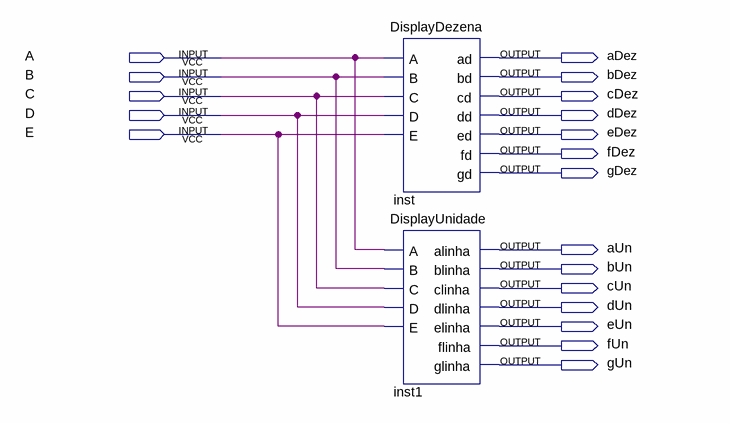
[diagram p0: schematic sheet]
// Quartus schematic Display14.bdf as structural Verilog: 2 symbols, 19 pins
module Display14 (
  input  A,
  input  B,
  input  C,
  input  D,
  input  E,
  output aDez,
  output bDez,
  output cDez,
  output dDez,
  output eDez,
  output fDez,
  output gDez,
  output aUn,
  output bUn,
  output cUn,
  output dUn,
  output eUn,
  output fUn,
  output gUn
);

  DisplayDezena inst (
    .A(A), .B(B), .C(C), .D(D), .E(E), .ad(aDez), .bd(bDez), .cd(cDez), .dd(dDez), .ed(eDez), .fd(fDez),
    .gd(gDez));
  DisplayUnidade inst1 (
    .A(A), .B(B), .C(C), .D(D), .E(E), .alinha(aUn), .blinha(bUn), .clinha(cUn), .dlinha(dUn), .elinha(eUn),
    .flinha(fUn), .glinha(gUn));
endmodule
